# Altium schematic sheet 09_Connectors.SchDoc
size A3; SheetNumber: 9; SheetTotal: 9
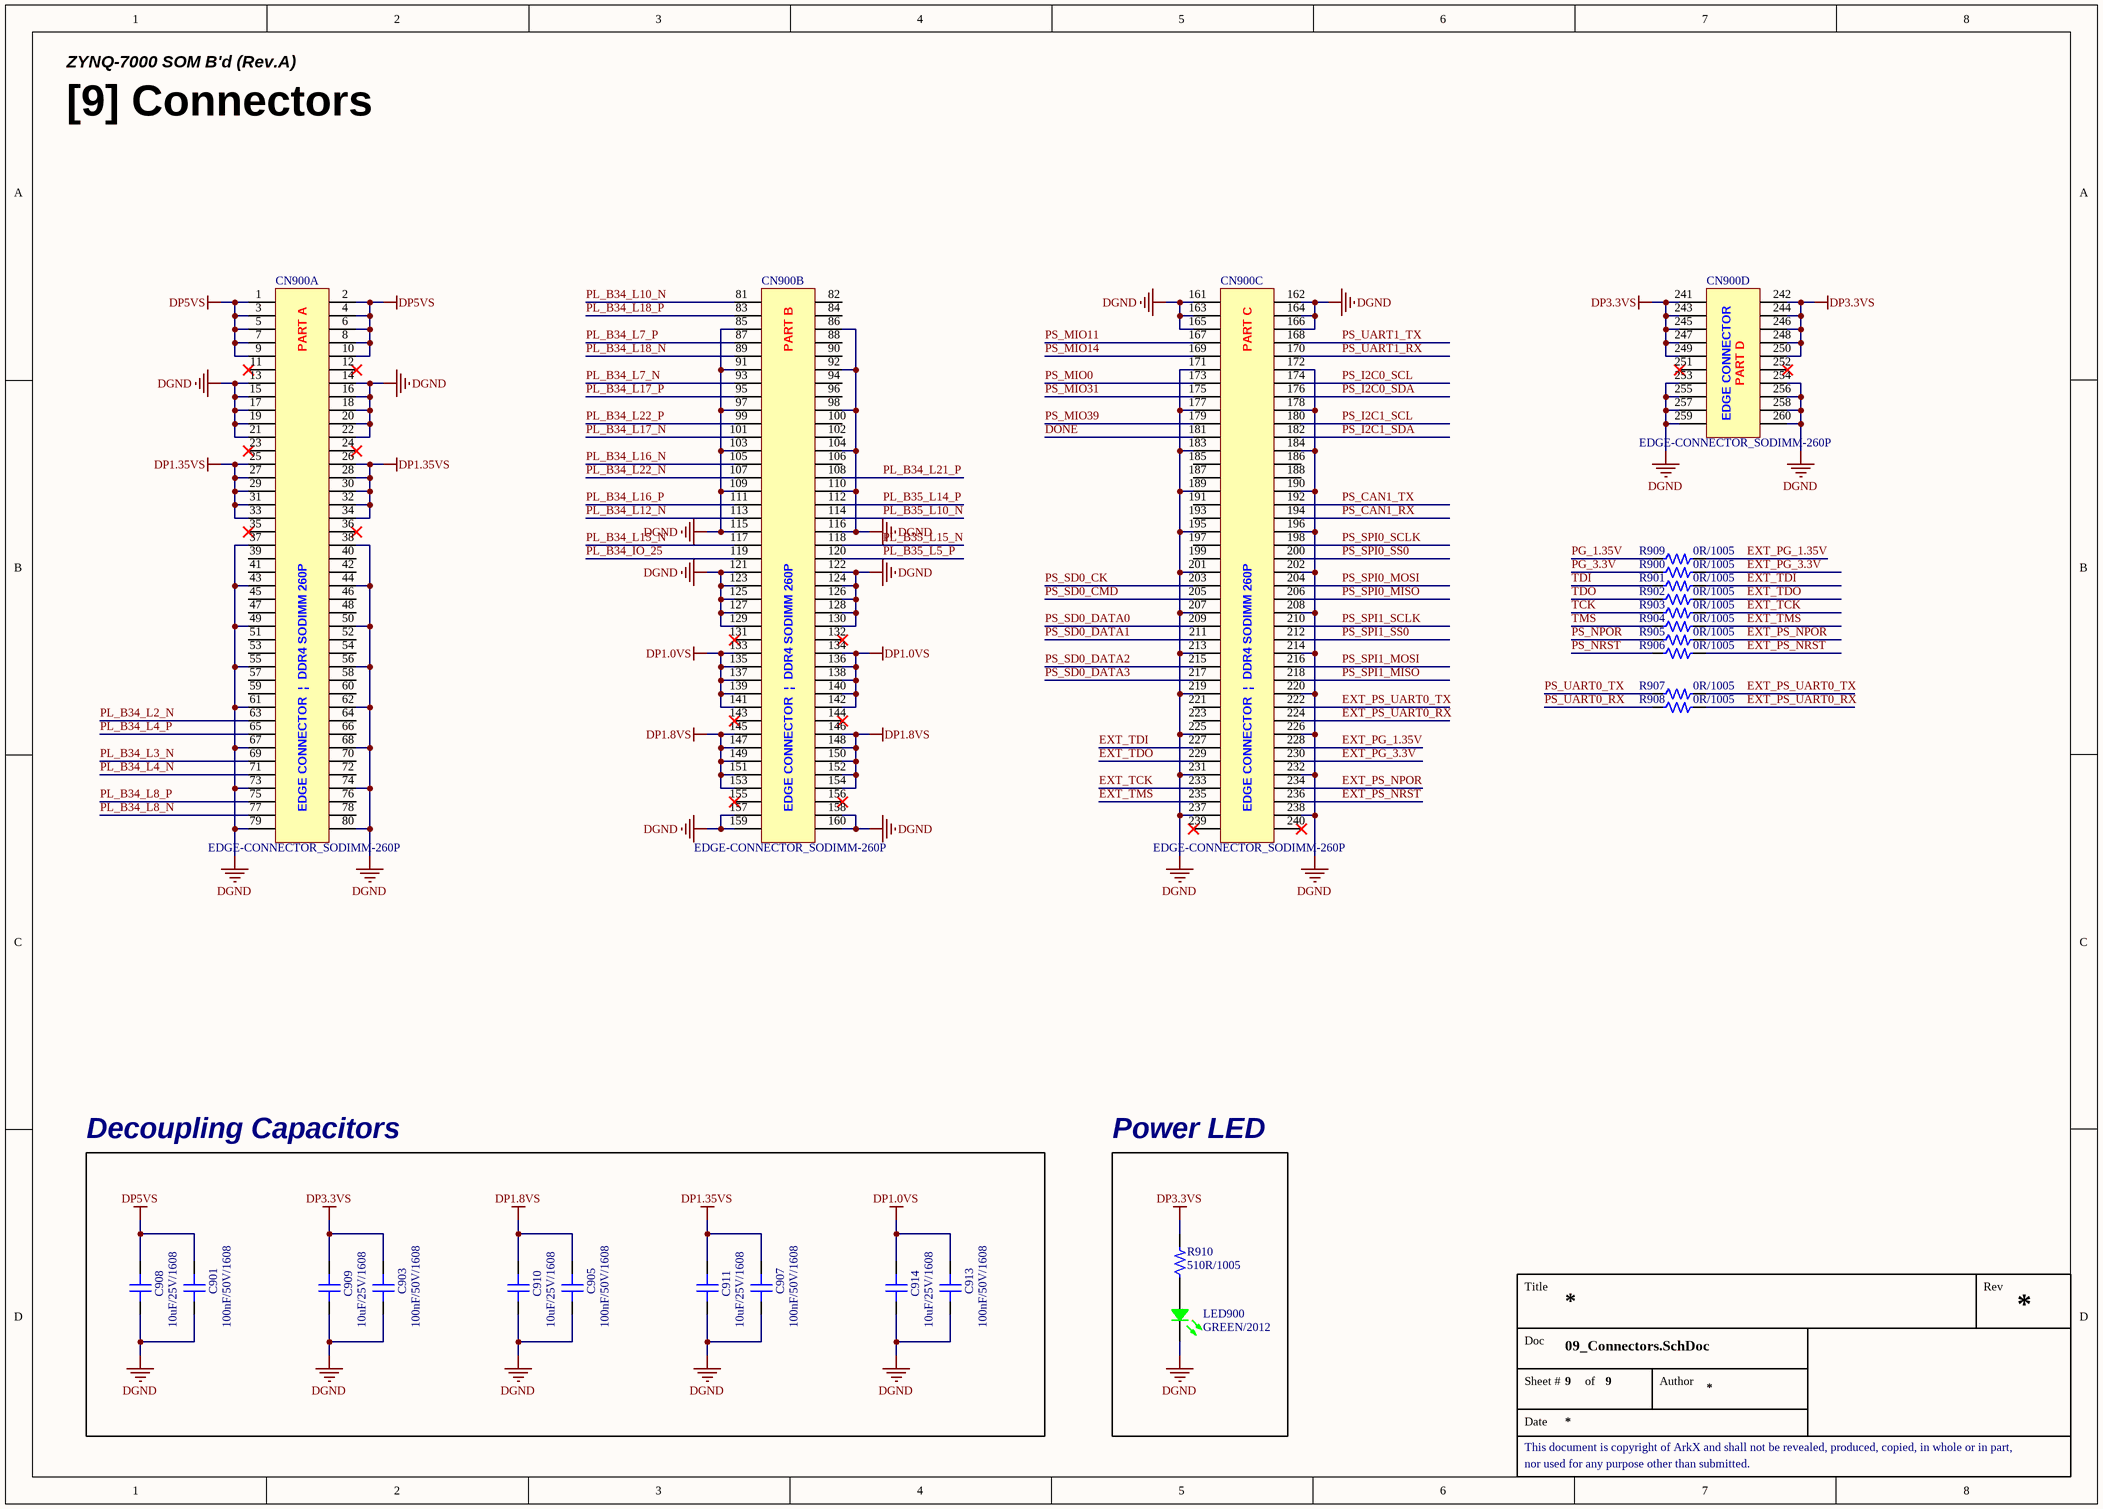
[diagram p0: 09_Connectors.SchDoc]

## Parts
C901  100nF/50V/1608  [CAP 1608 (0603_INCH)]
C903  100nF/50V/1608  [CAP 1608 (0603_INCH)]
C905  100nF/50V/1608  [CAP 1608 (0603_INCH)]
C907  100nF/50V/1608  [CAP 1608 (0603_INCH)]
C908  10uF/25V/1608  [CAP 1608 (0603_INCH)]
C909  10uF/25V/1608  [CAP 1608 (0603_INCH)]
C910  10uF/25V/1608  [CAP 1608 (0603_INCH)]
C911  10uF/25V/1608  [CAP 1608 (0603_INCH)]
C913  100nF/50V/1608  [CAP 1608 (0603_INCH)]
C914  10uF/25V/1608  [CAP 1608 (0603_INCH)]
CN900  EDGE-CONNECTOR_SODIMM-260P  [CON_EDGE-CONNECTOR_DDR4-SODIMM-260P]  (parts A,B,C,D of 4)
LED900  GREEN/2012  [LED MHT170RGBCT (GREEN)]
R900  0R/1005  [RES 1005 (0402_inch)]
R901  0R/1005  [RES 1005 (0402_inch)]
R902  0R/1005  [RES 1005 (0402_inch)]
R903  0R/1005  [RES 1005 (0402_inch)]
R904  0R/1005  [RES 1005 (0402_inch)]
R905  0R/1005  [RES 1005 (0402_inch)]
R906  0R/1005  [RES 1005 (0402_inch)]
R907  0R/1005  [RES 1005 (0402_inch)]
R908  0R/1005  [RES 1005 (0402_inch)]
R909  0R/1005  [RES 1005 (0402_inch)]
R910  510R/1005  [RES 1005 (0402_inch)]

## Blocks framed on the sheet
Decoupling Capacitors: C901 C903 C905 C907-C911 C913 C914
Power LED: LED900 R910

## Nets
DGND: C901.1 C903.1 C905.1 C907.1 C908.1 C909.1 C910.1 C911.1 C913.1 C914.1 CN900.13 CN900.14 CN900.15 CN900.16 CN900.17 CN900.18 CN900.19 CN900.20 CN900.21 CN900.22 CN900.37 CN900.38 CN900.43 CN900.44 CN900.49 CN900.50 CN900.55 CN900.56 CN900.61 CN900.62 CN900.67 CN900.68 CN900.73 CN900.74 CN900.79 CN900.80 CN900.85 CN900.86 CN900.91 CN900.92 CN900.97 CN900.98 CN900.103 CN900.104 CN900.109 CN900.110 CN900.115 CN900.116 CN900.121 CN900.122 CN900.123 CN900.124 CN900.125 CN900.126 CN900.127 CN900.128 CN900.129 CN900.130 CN900.157 CN900.158 CN900.159 CN900.160 CN900.161 CN900.162 CN900.163 CN900.164 CN900.165 CN900.166 CN900.171 CN900.172 CN900.177 CN900.178 CN900.183 CN900.184 CN900.189 CN900.190 CN900.195 CN900.196 CN900.201 CN900.202 CN900.207 CN900.208 CN900.213 CN900.214 CN900.219 CN900.220 CN900.225 CN900.226 CN900.231 CN900.232 CN900.237 CN900.238 CN900.253 CN900.254 CN900.255 CN900.256 CN900.257 CN900.258 CN900.259 CN900.260 LED900.2(GREEN)
DP1.0VS: C913.2 C914.2 CN900.133 CN900.134 CN900.135 CN900.136 CN900.137 CN900.138 CN900.139 CN900.140 CN900.141 CN900.142
DP1.8VS: C905.2 C910.2 CN900.145 CN900.146 CN900.147 CN900.148 CN900.149 CN900.150 CN900.151 CN900.152 CN900.153 CN900.154
DP1.35VS: C907.2 C911.2 CN900.25 CN900.26 CN900.27 CN900.28 CN900.29 CN900.30 CN900.31 CN900.32 CN900.33 CN900.34
DP3.3VS: C903.2 C909.2 CN900.241 CN900.242 CN900.243 CN900.244 CN900.245 CN900.246 CN900.247 CN900.248 CN900.249 CN900.250 R910.2
DP5VS: C901.2 C908.2 CN900.1 CN900.2 CN900.3 CN900.4 CN900.5 CN900.6 CN900.7 CN900.8 CN900.9 CN900.10
DONE: CN900.181
EXT_PG_1.35V: CN900.228 R909.2
EXT_PG_3.3V: CN900.230 R900.2
EXT_PS_NPOR: CN900.234 R905.2
EXT_PS_NRST: CN900.236 R906.2
EXT_PS_UART0_RX: CN900.224 R908.2
EXT_PS_UART0_TX: CN900.222 R907.2
EXT_TCK: CN900.233 R903.2
EXT_TDI: CN900.227 R901.2
EXT_TDO: CN900.229 R902.2
EXT_TMS: CN900.235 R904.2
PG_1.35V: R909.1
PG_3.3V: R900.1
PL_B34_IO_25: CN900.119
PL_B34_L2_N: CN900.63
PL_B34_L3_N: CN900.69
PL_B34_L4_N: CN900.71
PL_B34_L4_P: CN900.65
PL_B34_L7_N: CN900.93
PL_B34_L7_P: CN900.87
PL_B34_L8_N: CN900.77
PL_B34_L8_P: CN900.75
PL_B34_L10_N: CN900.81
PL_B34_L12_N: CN900.113
PL_B34_L15_N: CN900.117
PL_B34_L16_N: CN900.105
PL_B34_L16_P: CN900.111
PL_B34_L17_N: CN900.101
PL_B34_L17_P: CN900.95
PL_B34_L18_N: CN900.89
PL_B34_L18_P: CN900.83
PL_B34_L21_P: CN900.108
PL_B34_L22_N: CN900.107
PL_B34_L22_P: CN900.99
PL_B35_L5_P: CN900.120
PL_B35_L10_N: CN900.114
PL_B35_L14_P: CN900.112
PL_B35_L15_N: CN900.118
PS_CAN1_RX: CN900.194
PS_CAN1_TX: CN900.192
PS_I2C0_SCL: CN900.174
PS_I2C0_SDA: CN900.176
PS_I2C1_SCL: CN900.180
PS_I2C1_SDA: CN900.182
PS_MIO0: CN900.173
PS_MIO11: CN900.167
PS_MIO14: CN900.169
PS_MIO31: CN900.175
PS_MIO39: CN900.179
PS_NPOR: R905.1
PS_NRST: R906.1
PS_SD0_CK: CN900.203
PS_SD0_CMD: CN900.205
PS_SD0_DATA0: CN900.209
PS_SD0_DATA1: CN900.211
PS_SD0_DATA2: CN900.215
PS_SD0_DATA3: CN900.217
PS_SPI0_MISO: CN900.206
PS_SPI0_MOSI: CN900.204
PS_SPI0_SCLK: CN900.198
PS_SPI0_SS0: CN900.200
PS_SPI1_MISO: CN900.218
PS_SPI1_MOSI: CN900.216
PS_SPI1_SCLK: CN900.210
PS_SPI1_SS0: CN900.212
PS_UART0_RX: R908.1
PS_UART0_TX: R907.1
PS_UART1_RX: CN900.170
PS_UART1_TX: CN900.168
TCK: R903.1
TDI: R901.1
TDO: R902.1
TMS: R904.1
NetLED900_4: LED900.4(Common_Anode) R910.1

Not connected (* = marked no-connect by the designer): CN900 11* 12* 23* 24* 35* 36* 39 40 41 42 45 46 47 48 51 52 53 54 57 58 59 60 64 66 70 72 76 78 82 84 88 90 94 96 100 102 106 131* 132* 143* 144* 155* 156* 185 186 187 188 191 193 197 199 221 223 239* 240* 251* 252*

## Notes on the sheet
- ZYNQ-7000 SOM B'd (Rev.A)
- [9] Connectors
- Title
- Rev
- Doc
- Sheet #
- of
- Author
- This document is copyright of ArkX and shall not be revealed, produced, copied, in whole or in part,
- Date
- nor used for any purpose other than submitted.
- (in symbol CON_EDGE-CONNECTOR_DDR4-SODIMM-260P, part A) PART A; EDGE CONNECTOR  |  DDR4 SODIMM 260P
- (in symbol CON_EDGE-CONNECTOR_DDR4-SODIMM-260P, part B) PART B; EDGE CONNECTOR  |  DDR4 SODIMM 260P
- (in symbol CON_EDGE-CONNECTOR_DDR4-SODIMM-260P, part C) PART C; EDGE CONNECTOR  |  DDR4 SODIMM 260P
- (in symbol CON_EDGE-CONNECTOR_DDR4-SODIMM-260P, part D) EDGE CONNECTOR; PART D

## Library data of the parts
C901 C903 C905 C907 C913 = CAP_100nF/50V/1608: Ceramic CAP_100nF/50V/1608; LCSC Part #: C14663; JLCPCB Part Type: Basic Part
C908-C911 C914 = CAP_10uF/25V/1608: Ceramic CAP_10uF/25V/1608; LCSC Part #: C96446; JLCPCB Part Type: Basic Part
CN900 = CON_EDGE-CONNECTOR_DDR4-SODIMM-260P: EDGE-CONNECTOR_DDR4-SODIMM-260P; Mating Part Number: 2309409-1
LED900 = LED_MHT170RGBCT(GREEN): Colorless transparence -30℃~+85℃ Positive post Common anode RGB 120° 0805  Light Emitting Diodes (LED) ROHS; LCSC Part #: C2962094; JLCPCB Part Type: Extended Part
R900-R909 = RES_0R/1005/62.5mW: Value: 0R; Power Rating: 62.5mW; Precision: 1%; Size: 1005; LCSC Part #: C17168; JLCPCB Part Type: Basic Part
R910 = RES_510R/1005/62.5mW: Value: 510R; Power Rating: 62.5mW; Precision: 1%; Size: 1005; LCSC Part #: C25123; JLCPCB Part Type: Basic Part